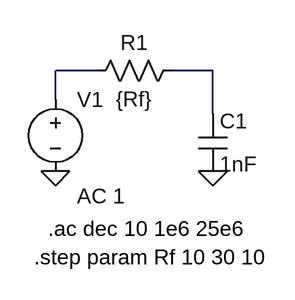
[diagram p0: schematic Draft3.asc]
Draft3.asc, the LTspice schematic file:
Version 4
SHEET 1 880 680
WIRE 160 96 112 96
WIRE 288 96 240 96
WIRE 112 128 112 96
WIRE 288 144 288 96
FLAG 288 208 0
FLAG 112 208 0
SYMBOL res 256 80 R90
WINDOW 0 0 56 VBottom 2
WINDOW 3 32 56 VTop 2
SYMATTR InstName R1
SYMATTR Value {Rf}
SYMBOL cap 272 144 R0
SYMATTR InstName C1
SYMATTR Value 1nF
SYMBOL voltage 112 112 R0
WINDOW 123 24 124 Left 2
WINDOW 39 0 0 Left 0
SYMATTR InstName V1
SYMATTR Value ""
SYMATTR Value2 AC 1
TEXT 104 272 Left 2 !.ac dec 10 1e6 25e6
TEXT 88 304 Left 2 !.step param Rf 10 30 10

The netlist it stands for:
* Draft3.asc
R1 N002 N001 {Rf}
C1 N002 0 1nF
V1 N001 0 AC 1
.ac dec 10 1e6 25e6
.step param Rf 10 30 10
.backanno
.end